# EAGLE design CentralBoard (EAGLE 9.6.2)
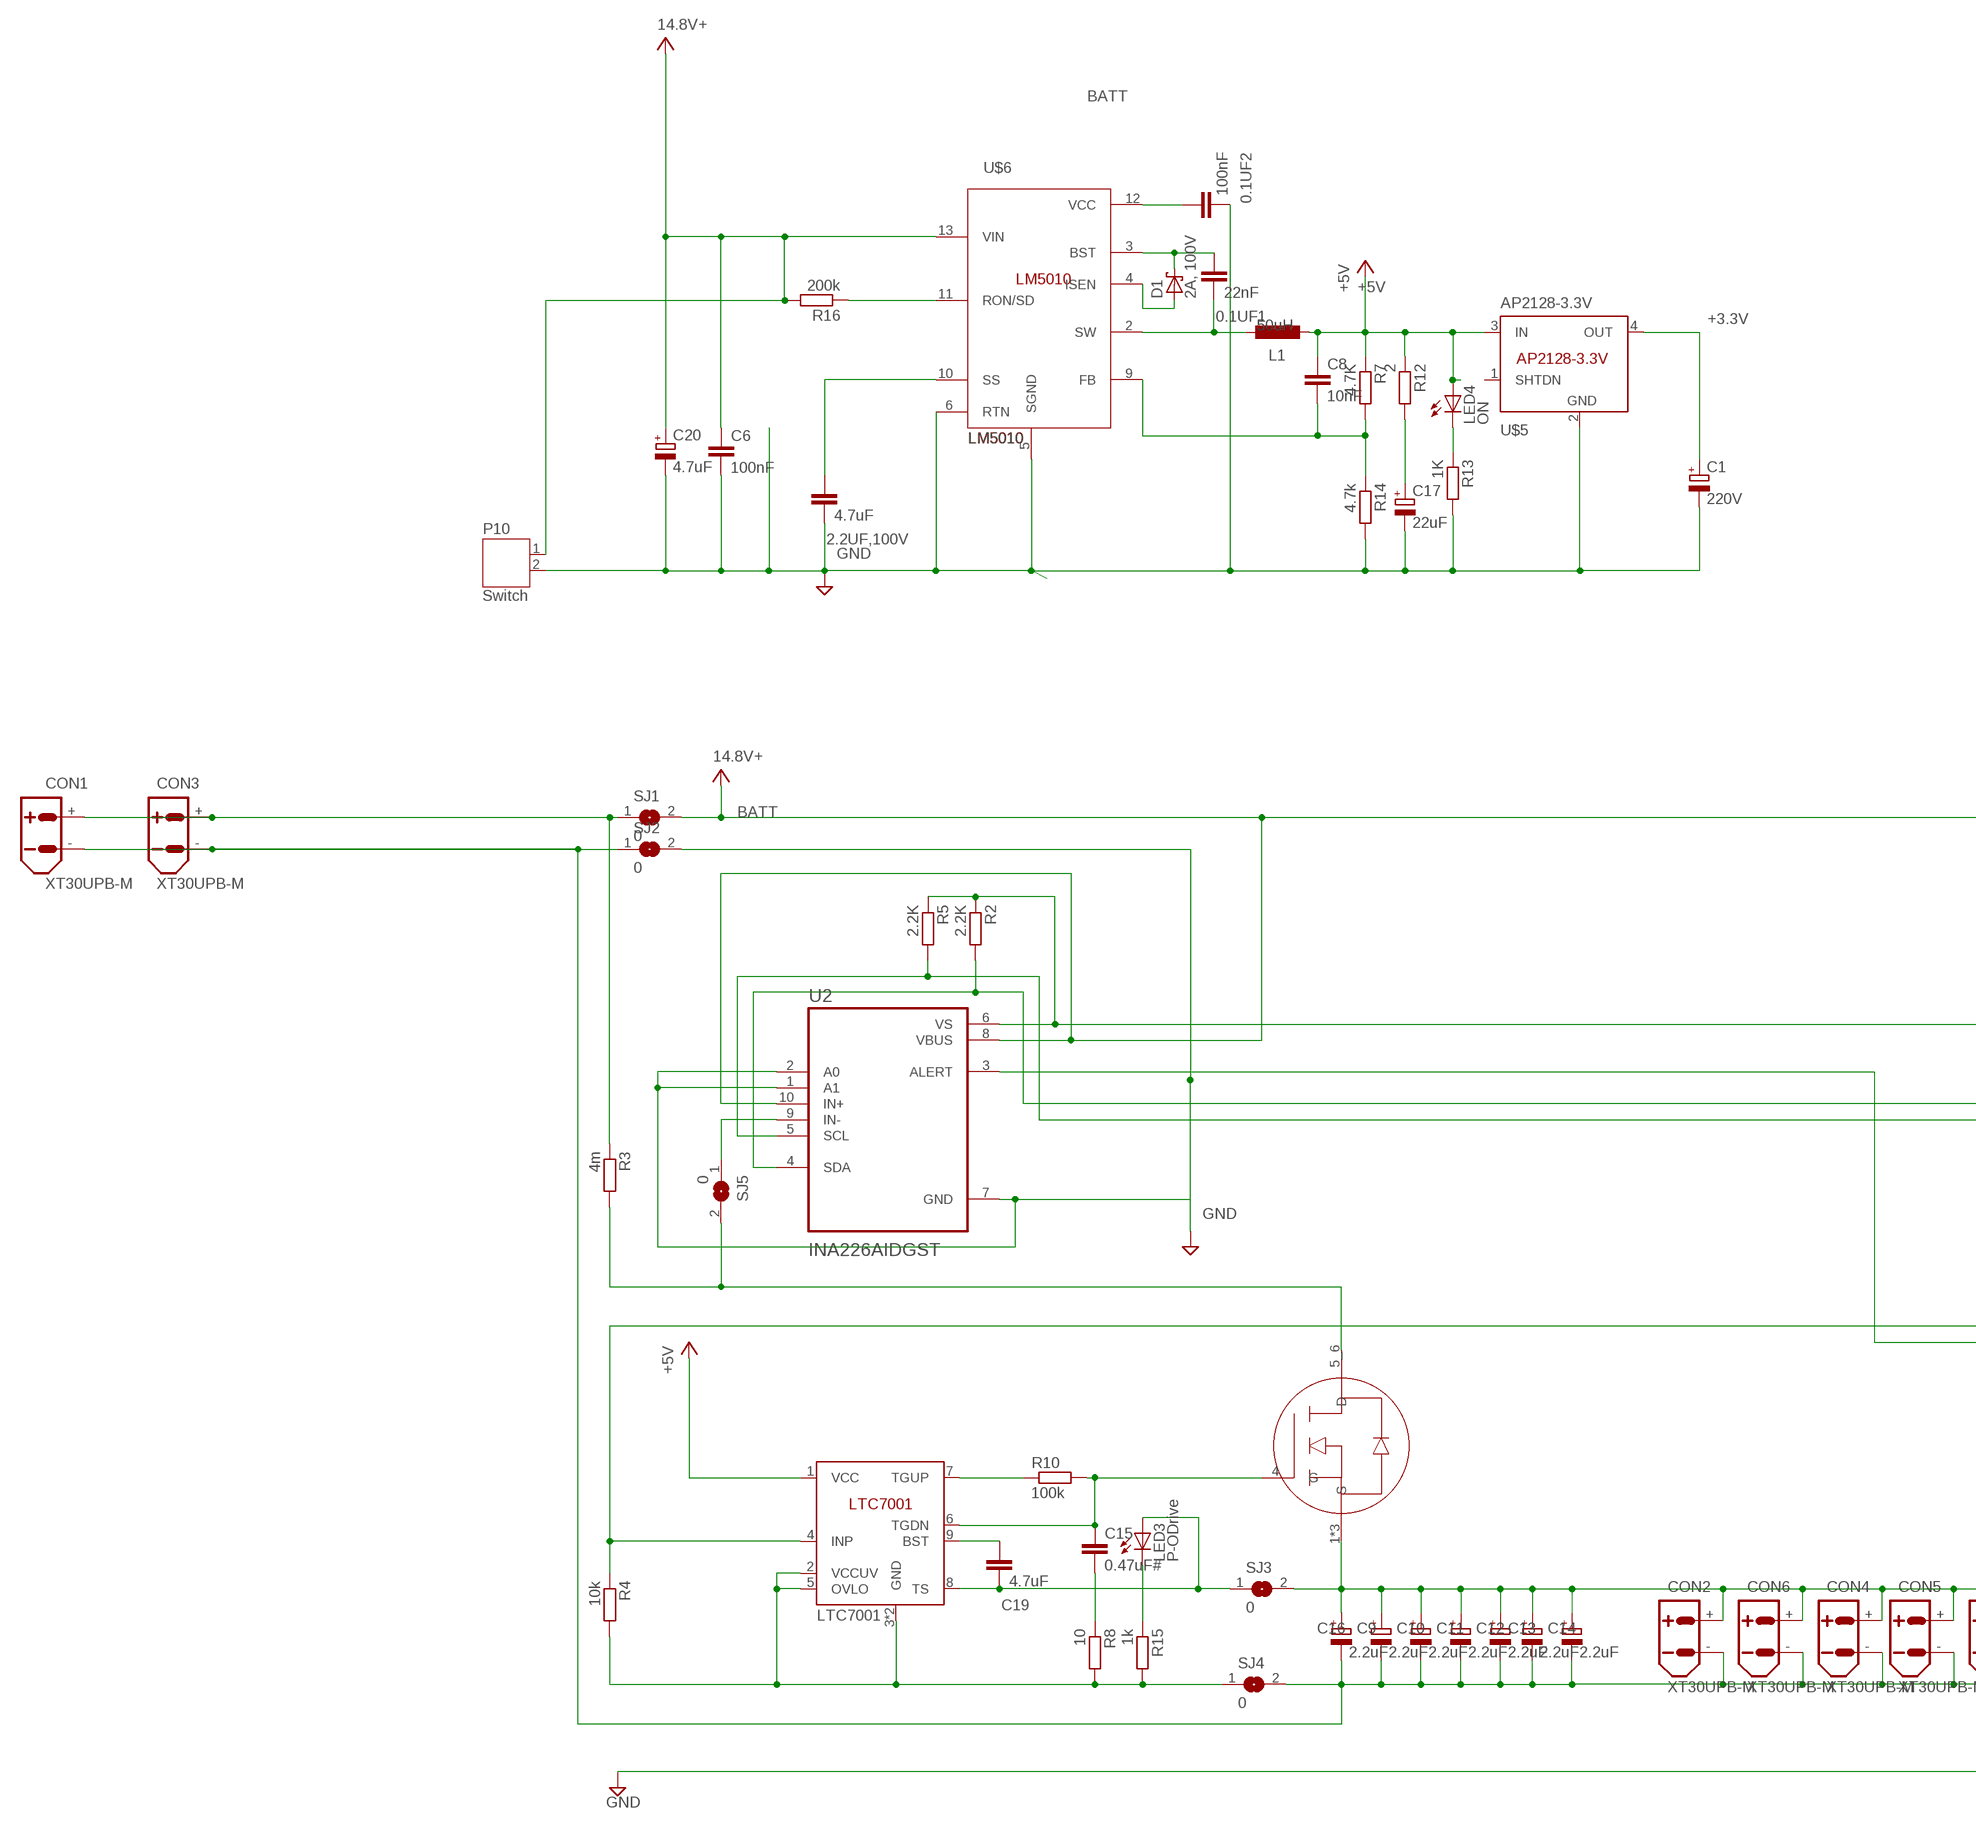
[diagram p0: schematic, sheet 1, part 1 of 2]
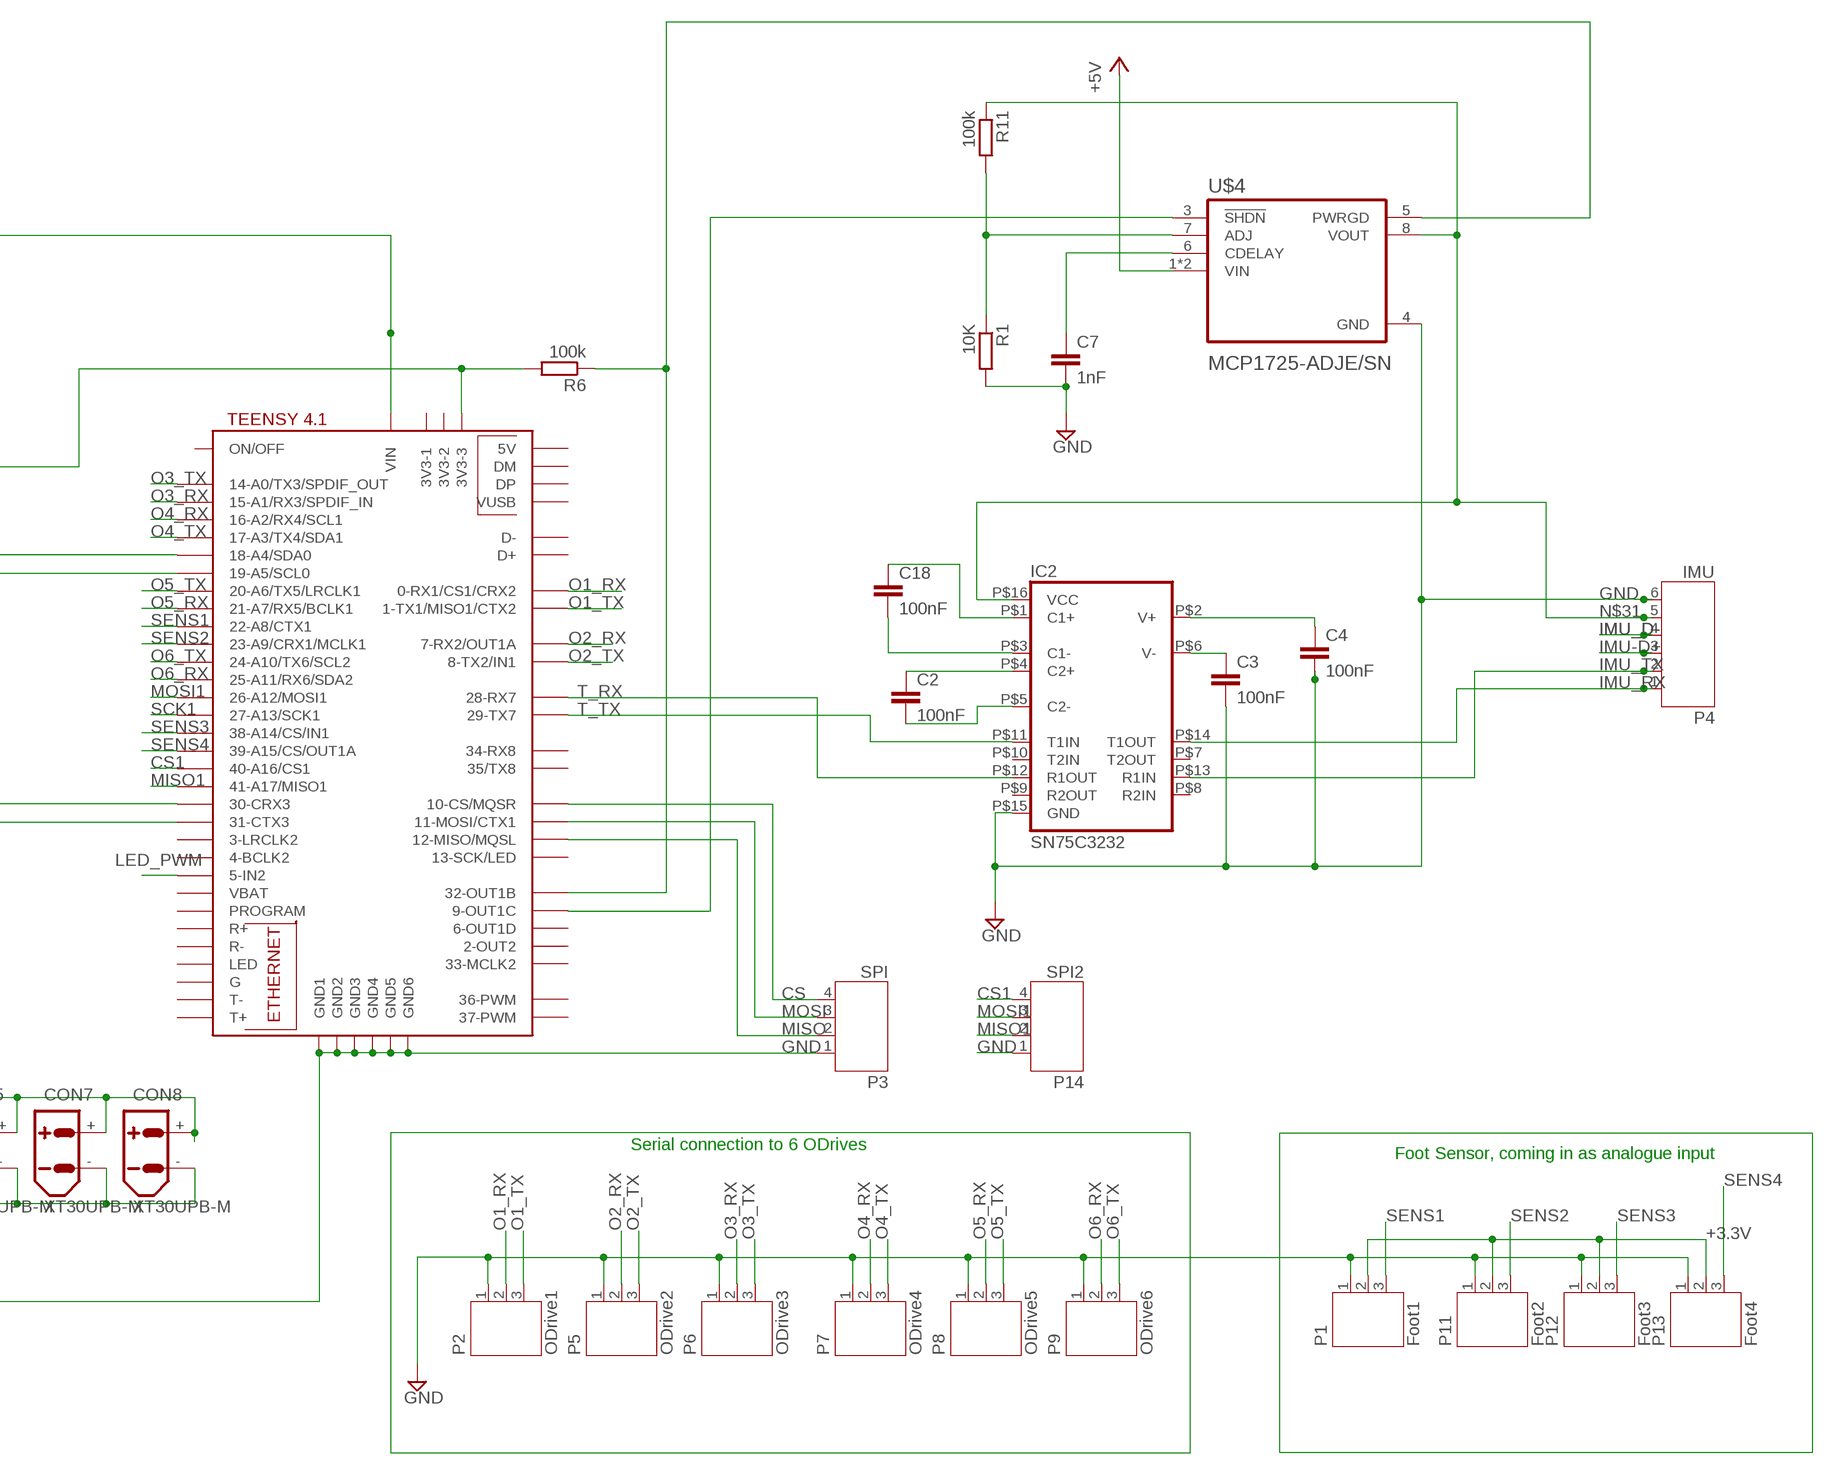
[diagram p1: schematic, sheet 1, part 2 of 2]

## Parts
0.1UF1  22nF  C-EU025-025X050  [C025-025X050]
0.1UF2  100nF  C-EU025-025X050  [C025-025X050]
2.2UF,100V  4.7uF  C-EU025-025X050  [C025-025X050]
C1  220V  CPOL-EUE2.5-7  [E2,5-7]
C2  100nF  C-EU025-025X050  [C025-025X050]
C3  100nF  C-EU025-025X050  [C025-025X050]
C4  100nF  C-EU025-025X050  [C025-025X050]
C6  100nF  C-EU025-025X050  [C025-025X050]
C7  1nF  C-EU025-025X050  [C025-025X050]
C8  10nF  C-EU025-025X050  [C025-025X050]
C9  2.2uF  CPOL-EUE2-5  [E2-5]
C10  2.2uF  CPOL-EUE2-5  [E2-5]
C11  2.2uF  CPOL-EUE2-5  [E2-5]
C12  2.2uF  CPOL-EUE2-5  [E2-5]
C13  2.2uF  CPOL-EUE2-5  [E2-5]
C14  2.2uF  CPOL-EUE2-5  [E2-5]
C15  0.47uF#  C-EU025-025X050  [C025-025X050]
C16  2.2uF  CPOL-EUE2-5  [E2-5]
C17  22uF  CPOL-EUE2-4  [E2-4]
C18  100nF  C-EU025-025X050  [C025-025X050]
C19  4.7uF  C-EU025-025X050  [C025-025X050]
C20  4.7uF  CPOL-EUE2-4  [E2-4]
CON1  XT30UPB-M  [XT30UPB-M]
CON2  XT30UPB-M  [XT30UPB-M]
CON3  XT30UPB-M  [XT30UPB-M]
CON4  XT30UPB-M  [XT30UPB-M]
CON5  XT30UPB-M  [XT30UPB-M]
CON6  XT30UPB-M  [XT30UPB-M]
CON7  XT30UPB-M  [XT30UPB-M]
CON8  XT30UPB-M  [XT30UPB-M]
D1  2A, 100V  SCHOTTKY-DIODEDO41  [DO41-10]
IC2  SN75C3232  MAX3232  [SOIC16]
IC3  LTC7001  [MSOP10]
L1  50uH  L-EU0204/5  [0204/5]
LED3  P-ODrive  LED3MM  [LED3MM]
LED4  ON  LED3MM  [LED3MM]
P1  Foot1  JST-PH3  [JST-PH3]
P2  ODrive1  JST-PH3  [JST-PH3]
P3  SPI  JST-PH4  [JST-PH4]
P4  IMU  JST-PH6  [JST-PH6]
P5  ODrive2  JST-PH3  [JST-PH3]
P6  ODrive3  JST-PH3  [JST-PH3]
P7  ODrive4  JST-PH3  [JST-PH3]
P8  ODrive5  JST-PH3  [JST-PH3]
P9  ODrive6  JST-PH3  [JST-PH3]
P10  Switch  JST-PH2  [JST-PH2]
P11  Foot2  JST-PH3  [JST-PH3]
P12  Foot3  JST-PH3  [JST-PH3]
P13  Foot4  JST-PH3  [JST-PH3]
P14  SPI2  JST-PH4  [JST-PH4]
R1  10K  R-EU_0204/7  [0204/7]
R2  2.2K  R-EU_0204/7  [0204/7]
R3  4m  R-EU_R2512  [R2512]
R4  10k  R-EU_0204/7  [0204/7]
R5  2.2K  R-EU_0204/7  [0204/7]
R6  100k  R-EU_0204/7  [0204/7]
R7  4.7K  R-EU_0204/7  [0204/7]
R8  10  R-EU_0204/7  [0204/7]
R10  100k  R-EU_0204/7  [0204/7]
R11  100k  R-EU_0204/7  [0204/7]
R12  2  R-EU_0204/7  [0204/7]
R13  1K  R-EU_0204/7  [0204/7]
R14  4.7k  R-EU_0204/7  [0204/7]
R15  1k  R-EU_0204/7  [0204/7]
R16  200k  R-EU_0204/7  [0204/7]
SJ1  0  SJ  [SJ]
SJ2  0  SJ  [SJ]
SJ3  0  SJ  [SJ]
SJ4  0  SJ  [SJ]
SJ5  0  SJ  [SJ]
U2  INA226AIDGST  [SOP50P490X110-10N]
U$1  TEENSY41  [TEENSY41]
U$2  DMTH8003SPS  NVMFS6H824NL-D  [DIO_NTS1045EMFST1G]
U$4  MCP1725-ADJE/SN  [SOIC127P599X175-8N]
U$5  AP2128-3.3V  [SOT-23-5]
U$6  LM5010  [TSSOP-14]

## Nets
+3.3V: C1.+ P1.2 P11.2 P12.2 P13.2 U$5.4(OUT)
+5V: C8.1 IC3.1(VCC) L1.2 LED4.A R7.1 R12.1 U$4.1(VIN) U$4.2(VIN) U$5.3(IN)
BATT: C6.1 C20.+ P10.1 R16.2 SJ1.2 U2.8(VBUS) U2.10(IN+) U$6.13(VIN) ; supply symbol labelled 14.8V+
BATT+ [Battery]: CON1.+ CON3.+ R3.1 SJ1.1
BATT- [Battery]: C9.- C10.- C11.- C12.- C13.- C14.- C16.- CON1.- CON2.- CON3.- CON4.- CON5.- CON6.- CON7.- CON8.- SJ2.1 SJ4.2
CS: P3.4 U$1.10-CS\MQSR(10-CS/MQSR)
CS1: P14.4 U$1.40-A16/CS1
GND: 0.1UF2.2 2.2UF,100V.2 C1.- C3.2 C4.2 C6.2 C7.2 C17.- C20.- IC2.P$15(GND) P1.1 P2.1 P3.1 P4.6 P5.1 P6.1 P7.1 P8.1 P9.1 P10.2 P11.1 P12.1 P13.1 P14.1 R1.2 R13.2 R14.2 SJ2.2 U2.1(A1) U2.2(A0) U2.7(GND) U$1.GND1 U$1.GND2 U$1.GND3 U$1.GND4 U$1.GND5 U$1.GND6 U$4.4(GND) U$5.2(GND) U$6.5(SGND) U$6.6(RTN)
IMU-D+: P4.3
IMU_D-: P4.4
IMU_RX: IC2.P$14(T1OUT) P4.1
IMU_TX: IC2.P$13(R1IN) P4.2
IMU_VDD: R6.1 U$1.32-OUT1B U$4.5(PWRGD)
LED_PWM: U$1.5-IN2
MISO: P3.2 U$1.12-MISO/MQSL
MISO1: P14.2 U$1.41-A17/MISO1
MOSI: P3.3 U$1.11-MOSI/CTX1
MOSI1: P14.3 U$1.26-A12/MOSI1
N$1: U$1.VIN
N$2: LED4.K(C) R13.1
N$3: C7.1 U$4.6(CDELAY)
N$4: IC3.7(TGUP) R10.1
N$5: U2.3(ALERT) U$1.31-CTX3
N$6: C18.1 IC2.P$1(C1+)
N$7: U$1.9-OUT1C U$4.3(!SHDN)
N$8: C18.2 IC2.P$3(C1-)
N$9 [Battery]: R3.2 SJ5.2 U$2.5_6(D)
N$10: IC3.4(INP) R4.1 U$1.30-CRX3
N$11: C2.1 IC2.P$4(C2+)
N$12: C2.2 IC2.P$5(C2-)
N$13: C4.1 IC2.P$2(V+)
N$14: C3.1 IC2.P$6(V-)
N$15: IC3.2(VCCUV) IC3.3(GND) IC3.5(OVLO) IC3.11(GND) R4.2 R8.2 R15.2 SJ4.1
N$16: C15.2 R8.1
N$17: R5.2 U2.5(SCL) U$1.19-A5/SCL0
N$18: SJ5.1 U2.9(IN-)
N$19: C15.1 IC3.6(TGDN) R10.2 U$2.4(G)
N$20: C17.+ R12.2
N$21 [Battery]: C9.+ C10.+ C11.+ C12.+ C13.+ C14.+ C16.+ CON2.+ CON4.+ CON5.+ CON6.+ CON7.+ CON8.+ SJ3.2 U$2.1(S) U$2.2(S) U$2.3(S)
N$22: R2.2 U2.4(SDA) U$1.18-A4/SDA0
N$23: R2.1 R5.1 R6.2 U2.6(VS) U$1.3V3-3
N$24: C19.1 IC3.9(BST)
N$25: R1.1 R11.2 U$4.7(ADJ)
N$26: C19.2 IC3.8(TS) LED3.A SJ3.1
N$27: R16.1 U$6.11(RON/SD)
N$29: 0.1UF1.1 D1.C U$6.3(BST)
N$30: LED3.K(C) R15.1
N$31: IC2.P$16(VCC) P4.5 R11.1 U$4.8(VOUT)
N$33: 2.2UF,100V.1 U$6.10(SS)
N$34: 0.1UF2.1 U$6.12(VCC)
N$35: 0.1UF1.2 L1.1 U$6.2(SW)
N$36: C8.2 R7.2 R14.1 U$6.9(FB)
N$37: D1.A U$6.4(ISEN)
O1_RX: P2.2 U$1.0-RX1/CS1/CRX2
O1_TX: P2.3 U$1.1-TX1/MISO1/CTX2
O2_RX: P5.2 U$1.7-RX2/OUT1A
O2_TX: P5.3 U$1.8-TX2/IN1
O3_RX: P6.2 U$1.15-A1/RX3/SPDIF_IN
O3_TX: P6.3 U$1.14-A0/TX3/SPDIF_OUT
O4_RX: P7.2 U$1.16-A2/RX4/SCL1
O4_TX: P7.3 U$1.17-A3/TX4/SDA1
O5_RX: P8.2 U$1.21-A7/RX5/BCLK1
O5_TX: P8.3 U$1.20-A6/TX5/LRCLK1
O6_RX: P9.2 U$1.25-A11/RX6/SDA2
O6_TX: P9.3 U$1.24-A10/TX6/SCL2
SCK1: U$1.27-A13/SCK1
SENS1: P1.3 U$1.22-A8/CTX1
SENS2: P11.3 U$1.23-A9/CRX1/MCLK1
SENS3: P12.3 U$1.38-A14/CS/IN1
SENS4: P13.3 U$1.39-A15/CS/OUT1A
T_RX: IC2.P$12(R1OUT) U$1.28-RX7
T_TX: IC2.P$11(T1IN) U$1.29-TX7
Unconnected: IC2.P$7(T2OUT) IC2.P$8(R2IN) IC2.P$9(R2OUT) IC2.P$10(T2IN) U$1.2-OUT2 U$1.3-LRCLK2 U$1.3V3-1 U$1.3V3-2 U$1.4-BCLK2 U$1.6-OUT1D U$1.13-SCK/LED U$1.33-MCLK2 U$1.34-RX8 U$1.35-TX8(35/TX8) U$1.36-PWM U$1.37-PWM U$1.+5V(5V) U$1.D+ U$1.D- U$1.DM U$1.DP U$1.G U$1.LED U$1.ON/OFF U$1.PROGRAM U$1.R+ U$1.R- U$1.T+ U$1.T- U$1.VBAT U$1.VUSB U$5.1(SHTDN)

## Notes on the sheet
- Serial connection to 6 ODrives
- Foot Sensor, coming in as analogue input

## Library data of the parts
0.1UF1 0.1UF2 2.2UF,100V C2-C4 C6-C8 C15 C18 C19 = rcl:C-EU: CAPACITOR, European symbol; SPICEPREFIX: C
C1 C9-C14 C16 C17 C20 = rcl:CPOL-EU: POLARIZED CAPACITOR, European symbol; SPICEPREFIX: C
CON1-CON8 = amass:XT30: AMASS XT30 connector Store in Japan AMASS XT30 connector <https://szc.jp/ams-xt30>
D1 = adafruit:SCHOTTKY-DIODE: Schottky Diode
IC2 = MAX3232:MAX3232: ±15kV ESD-Protected, Down to 10nA, 3.0V to 5.5V, Up to 1Mbps, True RS-232 Transceivers Check availability <https://pricing.snapeda.com/parts/MAX3232/Maxim%20Integrated/view-part?ref=eda>; AVAILABILITY: In Stock; DESCRIPTION: 2/2 Transceiver Full RS232 16-TQFN (5x5); MF: Maxim Integrated; MP: MAX3232; PACKAGE: SOIC-16 Texas Instruments; PRICE: None; PURCHASE-URL: https://pricing.snapeda.com/search/part/MAX3232/?ref=eda
IC3 = LTC7001:LTC7001: Fast 150V High Side NMOS Static Switch Driver Source: https://www.analog.com/en/products/ltc7001.html; MPN: AD7992BRMZ-0; OC_FARNELL: 1078311; OC_NEWARK: 31M4422
L1 = rcl:L-EU: INDUCTOR, European symbol; SPICEPREFIX: L
LED3 LED4 = adafruit:LED: LED OSRAM: - CHIPLED LG R971, LG N971, LY N971, LG Q971, LY Q971, LO R971, LY R971 LH N974, LH R974 LS Q976, LO Q976, LY Q976 LO Q996 - Hyper CHIPLED LW Q18S LB Q993, LB Q99A, LB R99A - SideLED LS A670, LO A670, LY A670, LG A670, LP A670 LB A673, LV A673, LT A673, LW A673 LH A674 LY A675 LS A676, LA A676, LO A676, LY A676, LW A676 LS A679, LY A679, LG A679 - Hyper Micro SIDELED® LS Y876, LA Y876, LO Y876, LY Y876 LT Y87S - SmartLED LW L88C, LW L88S LB L89C, LB L89S, LG L890 LS L89K, LO L89K, LY L89K LS L896, LA L896, LO L896, LY L896 - TOPLED LS T670, LO T670, LY T670, LG T670, LP T670 LSG T670, LSP T670, LSY T670, LOP T670, LYG T670 LG T671, LOG T671, LSG T671 LB T673, LV T673, LT T673, LW T673 LH T674 LS T676, LA T676, LO T676, LY T676, LB T676, LH T676, LSB T676, LW T676 LB T67C, LV T67C, LT T67C, LS T67K, LO T67K, LY T67K, LW E67C LS E67B, LA E67B, LO E67B, LY E67B, LB E67C, LV E67C, LT E67C LW T67C LS T679, LY T679, LG T679 LS T770, LO T770, LY T770, LG T770, LP T770 LB T773, LV T773, LT T773, LW T773 LH T774 LS E675, LA E675, LY E675, LS T675 LS T776, LA T776, LO T776, LY T776, LB T776 LHGB T686 LT T68C, LB T68C - Hyper Mini TOPLED® LB M676 - Mini TOPLED Santana® LG M470 LS M47K, LO M47K, LY M47K Source: http://www.osram.convergy.de/
P1 P2 P5-P9 P11-P13 = jst-ph:JST-PH3
P3 P14 = jst-ph:JST-PH4
P4 = jst-ph:JST-PH6
P10 = jst-ph:JST-PH2
R1 R2 R4-R8 R10-R16 = rcl:R-EU_: RESISTOR, European symbol; SPICEPREFIX: R
R3 = rcl:R-EU_: RESISTOR, European symbol; DIGIKEY: 541-WSK25124L000FEACT-ND; LINK: https://octopart.com/wsk25124l000fea-vishay-41934978?r=sp; MOUSER: 71-WSK25124L000FEA; SPICEPREFIX: R
SJ1-SJ5 = jumper:SJ: SMD solder JUMPER
U2 = INA226AIDGST:INA226AIDGST: Check availability <https://pricing.snapeda.com/parts/INA226AIDGST/Texas%20Instruments/view-part?ref=eda>; AVAILABILITY: In Stock; DESCRIPTION: 36V, 16-bit, ultra-precise i2c output current/voltage/power monitor w/alert; MF: Texas Instruments; MP: INA226AIDGST; PACKAGE: VSSOP-10 Texas Instruments; PRICE: None; PURCHASE-URL: https://pricing.snapeda.com/search/part/INA226AIDGST/?ref=eda
U$1 = teensy:TEENSY41
U$2 = DIO_NTS1045EMFST1G:NVMFS6H824NL-D
U$4 = MCP1725-ADJE_SN:MCP1725-ADJE/SN: Check availability <https://pricing.snapeda.com/parts/MCP1725-ADJE/SN/Microchip/view-part?ref=eda>; AVAILABILITY: In Stock; DESCRIPTION: Linear Voltage Regulator IC Positive Adjustable 1 Output 500mA 8-SOIC; MF: Microchip; MP: MCP1725-ADJE/SN; PACKAGE: SOIC-8 Microchip; PRICE: None; PURCHASE-URL: https://pricing.snapeda.com/search/part/MCP1725-ADJE/SN/?ref=eda
U$5 = AP2128:AP2128-3.3V: AP2128-3.3V 300mA HIGH SPEED, EXTREMELY LOW NOISE CMOS LDO REGULATOR https://www.diodes.com/assets/Datasheets/AP2128.pdf
U$6 = LM5010:LM5010: LM5010 High-Voltage 1-A Step-Down Switching Regulator https://www.ti.com/lit/ds/symlink/lm5010.pdf?ts=1653069920582

## Net classes
0 default: width 0.254 mm
1 Battery: width 1.397 mm

## Board
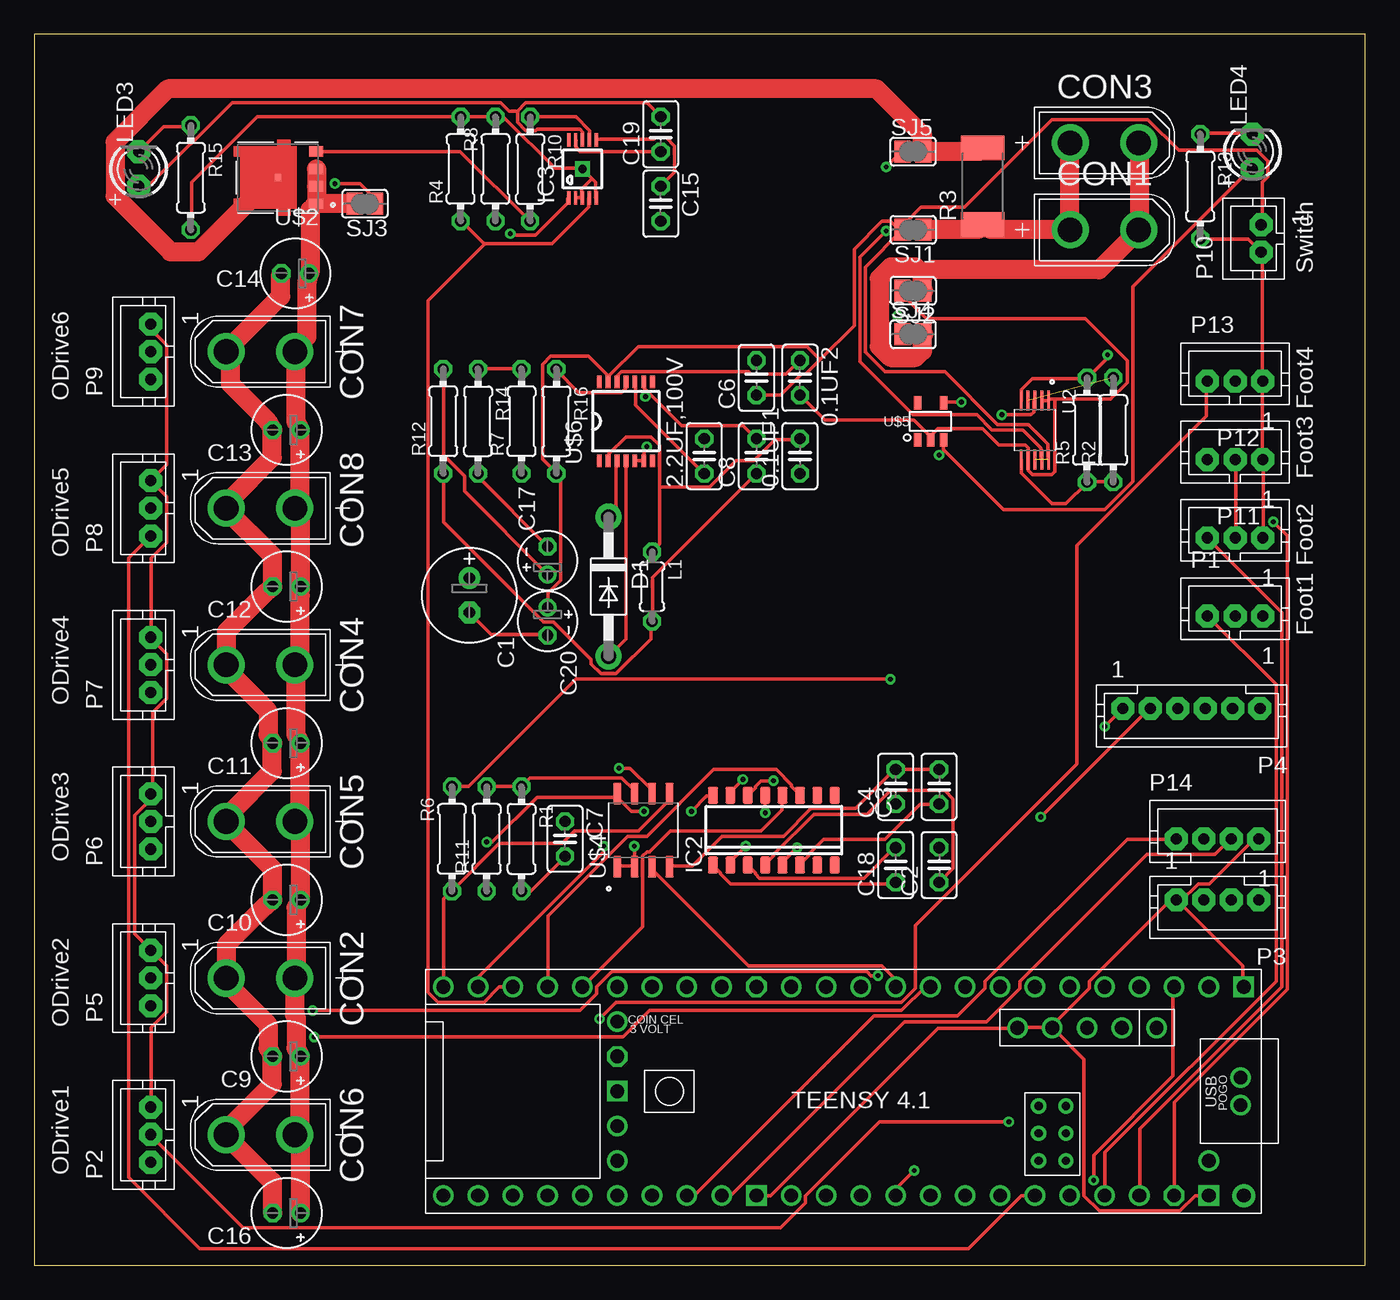
[diagram p2: board, top side]
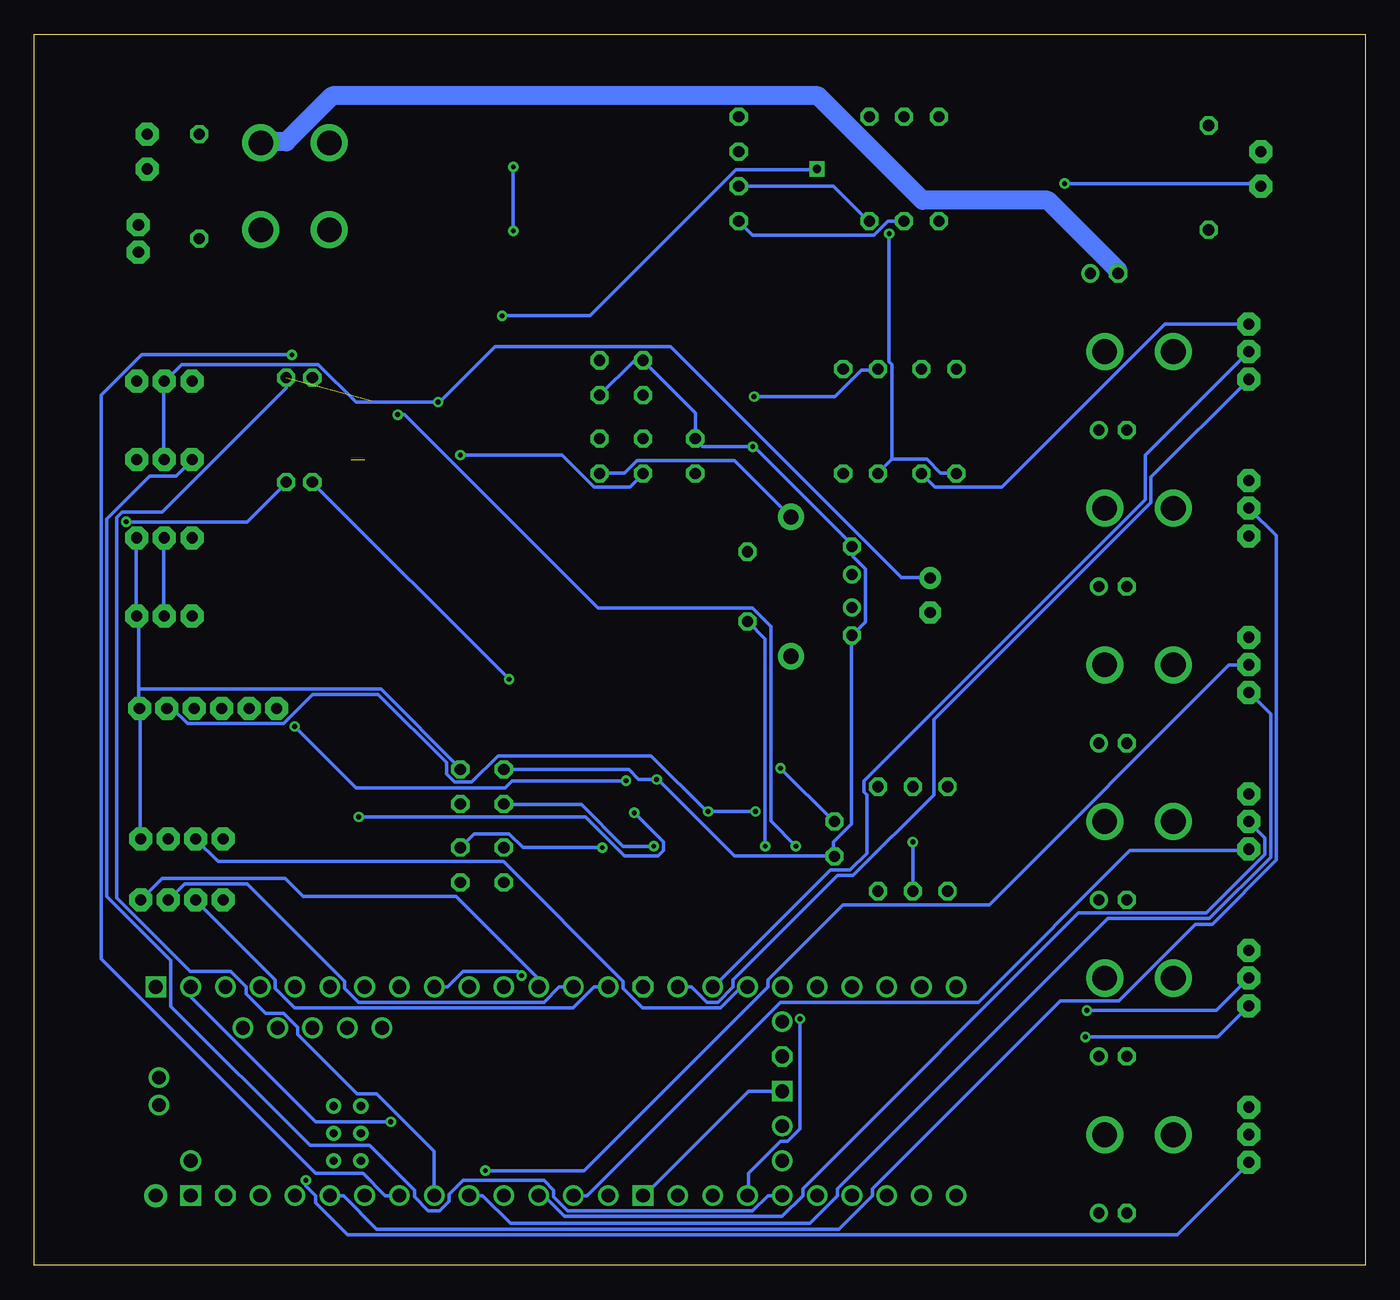
[diagram p3: board, bottom side, seen from below]

Size 97.14 x 89.84 mm. Coordinates in mm from the lower left corner, seen from the top.
Outline: 0,0 97.14,0 97.14,89.84 0,89.84 0,0
Copper layers (1*16): Top 0.035mm / dielectric 1.5mm / Bottom 0.035mm
Design rules "default": minimum track width 6mil, minimum drill 0.35mm, track to track 6mil, track to pad 6mil, pad to pad 6mil, via to via 6mil, smd to smd 6mil, copper to edge 40mil, drill to drill 6mil, minimum pad ring 10mil, minimum via ring 8mil, stop-mask expansion 4mil, vias tented up to drill 0mil, thermal gap 10mil

### Footprints (pad centres in the part's own frame; a part is rotated, then mirrored left to right if it is on the bottom)
C025-025X050 = drill 0.813 octagon: 1 -1.27,0; 2 1.27,0
E2,5-7 = drill 0.813 pad 1.6: + -1.27,0 | drill 0.813 pad 1.6 octagon: - 1.27,0
E2-5 = drill 0.813 pad 1.27: + -1.016,0 | drill 0.813 pad 1.27 octagon: - 1.016,0
E2-4 = drill 0.813 pad 1.27: + -1.016,0 | drill 0.813 pad 1.27 octagon: - 1.016,0
XT30UPB-M = drill 1.8: + 2.5,0; - -2.5,0
DO41-10 = drill 1.118 pad 1.93: A 5.08,0; C -5.08,0
SOIC16 = smd 0.75 x 1.25: P$1 -4.445,-2.54; P$2 -3.175,-2.54; P$3 -1.905,-2.54; P$4 -0.635,-2.54; P$5 0.635,-2.54; P$6 1.905,-2.54; P$7 3.175,-2.54; P$8 4.445,-2.54; P$9 4.445,2.54; P$10 3.175,2.54; P$11 1.905,2.54; P$12 0.635,2.54; P$13 -0.635,2.54; P$14 -1.905,2.54; P$15 -3.175,2.54; P$16 -4.445,2.54
MSOP10 = smd 0.25 x 1: 1 -1,-2.113; 2 -0.5,-2.113; 3 0,-2.113; 4 0.5,-2.113; 5 1,-2.113; 6 1,2.113; 7 0.5,2.113; 8 0,2.113; 9 -0.5,2.113; 10 -1,2.113 | drill 0.6 square: 11 0,0
0204/5 = drill 0.813 octagon: 1 -2.54,0; 2 2.54,0
LED3MM = drill 0.813 pad 1.676 octagon: A -1.27,0; K 1.27,0
JST-PH3 = drill 0.813 pad 1.676 octagon: 1 2.016,-1.524; 2 0.016,-1.524; 3 -2.016,-1.524
JST-PH4 = drill 0.813 pad 1.676 octagon: 1 3,0; 2 1,0; 3 -1,0; 4 -3,0
JST-PH6 = drill 0.813 pad 1.676 octagon: 1 5,0; 2 3,0; 3 1,0; 4 -1,0; 5 -3,0; 6 -5,0
JST-PH2 = drill 0.813 pad 1.676 octagon: 1 1,0; 2 -1,0
0204/7 = drill 0.813 octagon: 1 -3.81,0; 2 3.81,0
R2512 = smd 1.8 x 3.2: 1 -2.8,0; 2 2.8,0
SJ = smd 1.168 x 1.6: 1 -0.762,0; 2 0.762,0
SOP50P490X110-10N = smd 1.47 x 0.28: 1 -2.15,1; 2 -2.15,0.5; 3 -2.15,0; 4 -2.15,-0.5; 5 -2.15,-1; 6 2.15,-1; 7 2.15,-0.5; 8 2.15,0; 9 2.15,0.5; 10 2.15,1
TEENSY41 = drill 1: 0-RX1/CS1/CRX2 -27.94,-7.62; 1-TX1/MISO1/CTX2 -25.4,-7.62; 2-OUT2 -22.86,-7.62; 3-LRCLK2 -20.32,-7.62; 4-BCLK2 -17.78,-7.62; 5-IN2 -15.24,-7.62; 6-OUT1D -12.7,-7.62; 7-RX2/OUT1A -10.16,-7.62; 8-TX2/IN1 -7.62,-7.62; 9-OUT1C -5.08,-7.62; 10-CS\MQSR -2.54,-7.62; 11-MOSI/CTX1 0,-7.62; 12-MISO/MQSL 2.54,-7.62; 13-SCK/LED 2.54,7.62; 14-A0/TX3/SPDIF_OUT 0,7.62; 15-A1/RX3/SPDIF_IN -2.54,7.62; 16-A2/RX4/SCL1 -5.08,7.62; 17-A3/TX4/SDA1 -7.62,7.62; 18-A4/SDA0 -10.16,7.62; 19-A5/SCL0 -12.7,7.62; 20-A6/TX5/LRCLK1 -15.24,7.62; 21-A7/RX5/BCLK1 -17.78,7.62; 22-A8/CTX1 -20.32,7.62; 23-A9/CRX1/MCLK1 -22.86,7.62; 24-A10/TX6/SCL2 7.62,-7.62; 25-A11/RX6/SDA2 10.16,-7.62; 26-A12/MOSI1 12.7,-7.62; 27-A13/SCK1 15.24,-7.62; 28-RX7 17.78,-7.62; 29-TX7 20.32,-7.62; 30-CRX3 22.86,-7.62; 31-CTX3 25.4,-7.62; 32-OUT1B 27.94,-7.62; 33-MCLK2 27.94,7.62; 34-RX8 25.4,7.62; 35-TX8 22.86,7.62; 36-PWM 20.32,7.62; 37-PWM 17.78,7.62; 38-A14/CS/IN1 15.24,7.62; 39-A15/CS/OUT1A 12.7,7.62; 40-A16/CS1 10.16,7.62; 41-A17/MISO1 7.62,7.62; +5V -24.13,-4.62; D+ -30.25,-1; D- -30.25,1; DM -21.59,-4.62; DP -19.05,-4.62; GND4 -16.51,-4.62; GND5 -13.97,-4.62; ON/OFF 15.24,5.08; PROGRAM 15.24,2.54; VBAT 15.24,-5.08; VUSB -27.94,5.08 | drill 1 octagon: 3V3-1 5.08,-7.62; 3V3-2 15.24,-2.54; 3V3-3 -25.4,7.62 | drill 0.6: G -15.51,3.08; LED -17.51,3.08; R+ -17.51,5.08; R- -15.51,5.08; T+ -15.51,1.08; T- -17.51,1.08 | drill 1 square: GND1 -30.48,-7.62; GND2 15.24,0; GND3 5.08,7.62; GND6 -27.94,7.62 | drill 1 pad 1.676: VIN -30.48,7.62
DIO_NTS1045EMFST1G = smd 1 x 0.75: 1 -2.795,1.905; 2 -2.795,0.635; 3 -2.795,-0.635; 4 -2.795,-1.905 | smd 0.5 x 0.5: 5_6 0,0
SOIC127P599X175-8N = smd 1.58 x 0.6: 1 -2.67,1.905; 2 -2.67,0.635; 3 -2.67,-0.635; 4 -2.67,-1.905; 5 2.67,-1.905; 6 2.67,-0.635; 7 2.67,0.635; 8 2.67,1.905
SOT-23-5 = smd 1 x 0.55: 1 -1.35,0.95; 2 -1.35,0; 3 -1.35,-0.95; 4 1.35,-0.95; 5 1.35,0.95
TSSOP-14 = smd 0.9 x 0.35: 1 -2.875,1.95; 2 -2.875,1.3; 3 -2.875,0.65; 4 -2.875,0; 5 -2.875,-0.65; 6 -2.875,-1.3; 7 -2.875,-1.95; 8 2.875,-1.95; 9 2.875,-1.3; 10 2.875,-0.65; 11 2.875,0; 12 2.875,0.65; 13 2.875,1.3; 14 2.875,1.95

### Placement (x,y rotation side)
0.1UF1  55.88,59.05 90 top
0.1UF2  55.88,64.77 270 top
2.2UF,100V  48.9,59.05 90 top
C1  31.75,48.9 270 top
C2  66.04,29.21 90 top
C3  66.04,34.92 90 top
C4  62.87,34.92 90 top
C6  52.7,64.77 90 top
C7  38.73,31.11 270 top
C8  52.7,59.05 90 top
C9  18.41,15.24 180 top
C10  18.41,26.67 180 top
C11  18.41,38.1 180 top
C12  18.41,49.53 180 top
C13  18.41,60.96 180 top
C14  19.05,72.39 180 top
C15  45.72,77.47 270 top
C16  18.41,3.81 180 top
C17  37.47,51.44 90 top
C18  62.87,29.21 90 top
C19  45.72,82.55 90 top
C20  37.47,46.99 270 top
CON1  78.11,75.56 180 top
CON2  16.51,20.95 0 top
CON3  78.11,81.92 180 top
CON4  16.51,43.81 0 top
CON5  16.51,32.38 0 top
CON6  16.51,9.53 0 top
CON7  16.51,66.67 0 top
CON8  16.51,55.24 0 top
D1  41.91,49.53 270 top
IC2  53.98,31.75 0 top
IC3  40.01,80.01 0 top
L1  45.09,49.53 270 top
LED3  7.62,80.01 90 top
LED4  88.9,81.28 90 top
P1  87.63,48.9 0 top
P2  6.99,9.53 90 top
P3  86.36,26.67 180 top
P4  84.45,40.64 180 top
P5  6.99,20.95 90 top
P6  6.99,32.38 90 top
P7  6.99,43.81 90 top
P8  6.99,55.24 90 top
P9  6.99,66.67 90 top
P10  89.53,74.93 90 top
P11  87.63,54.61 0 top
P12  87.63,60.33 0 top
P13  87.63,66.04 0 top
P14  86.36,31.11 0 top
R1  35.56,31.11 270 top
R2  78.74,60.96 90 top
R3  69.22,78.74 90 top
R4  31.11,80.01 90 top
R5  76.83,60.96 90 top
R6  30.48,31.11 90 top
R7  35.56,61.59 90 top
R8  33.66,80.01 90 top
R10  36.2,80.01 270 top
R11  33.02,31.11 90 top
R12  29.84,61.59 90 top
R13  85.09,78.74 270 top
R14  32.38,61.59 270 top
R15  11.43,79.38 270 top
R16  38.1,61.59 270 top
SJ1  64.14,75.56 180 top
SJ2  64.14,71.12 180 top
SJ3  24.13,77.47 180 top
SJ4  64.14,67.94 0 top
SJ5  64.14,81.28 0 top
U2  73.03,60.96 270 top
U$1  57.78,12.7 180 top
U$2  17.78,79.38 180 top
U$4  44.45,31.75 90 top
U$5  65.41,61.59 90 top
U$6  43.18,61.59 90 top

### Tracks (layer width: path | path; a pad name or v marks a point on that pad's centre or on a via)
+3.3V  (via drill 0.35)
  Top 0.254: v67.67,62.99 66.45,62.99 U$5.4 | P11.2 87.68,53.14 87.68,58.73 P12.2
  Bottom 0.254: P1.2 87.68,47.45 87.68,53.03 P11.2 | C1.+ 31.8,50.19 33.83,50.19 50.7,67.06 63.5,67.06 67.56,62.99 v67.67,62.99 73.66,62.99 76.4,65.73 86.36,65.73 87.58,64.52 P13.2 87.68,64.41 87.68,58.83 P12.2
+5V  (via drill 0.35)
  Top 0.254: v34.75,75.29 34.85,75.18 36.58,75.18 38.91,77.52 38.91,77.83 IC3.1 | U$4.1 42.57,29.16 43.79,29.16 U$4.2 43.79,29.26 v43.79,30.58 | 66.34,59.44 66.34,60.15 U$5.3 | v66.04,59.13 66.34,59.44 | LED4.A 88.9,79.96 88.7,79.96 80.16,71.42 80.16,57.2 78.13,55.17 70.71,55.17 66.45,59.44 66.34,59.44 | C8.1 45.11,50.19 45.11,47.04 L1.2 45.01,46.94 45.01,45.72 42.47,43.18 41.35,43.18 40.64,43.89 40.64,44.2 37.9,46.94 37.19,46.94 29.87,54.25 29.87,57.71 R12.1
  Bottom 0.254: v34.75,75.29 34.75,65.94 34.54,65.73 34.54,58.83 | 34.54,58.83 35.56,57.81 R7.1 | 34.54,58.83 32,58.83 30.99,57.81 29.87,57.81 R12.1 | v43.79,30.58 43.79,45.72 45.01,46.94 L1.2 | v66.04,59.13 58.62,59.13 56.29,56.79 53.65,56.79 52.73,57.71 C8.1
BATT  (1 unrouted)
  Top 0.254: 41.86,64.92 41.86,64.52 U$6.13 | 41.86,64.92 40.44,66.34 37.69,66.34 37.08,65.73 37.08,58.83 38.1,57.81 R16.2 38.2,57.71 38.41,57.51 38.41,49.99 37.49,49.07 37.49,48.06 C20.+ | SJ1.2 60.66,72.85 60.66,66.65 62.08,65.23 66.45,65.23 70.31,61.37 72.54,61.37 73.97,59.94 73.97,58.83 U2.10 | C6.1 54.46,63.5 55.98,65.02 56.29,65.02 57.35,66.09 | 57.35,66.09 59.84,68.58 59.84,74.17 61.87,76.2 62.48,76.2 63.2,75.49 SJ1.2 | P10.1 89.61,76 89.61,79.05 90.02,79.45 90.02,80.57 89.2,81.38 83.52,81.38 81.28,83.62 74.27,83.62 67.87,77.22 64.72,77.22 63.5,76 63.5,75.59 SJ1.2 | 57.35,66.09 56.39,67.06 44.09,67.06 41.96,64.92 41.86,64.92
BATT+
  Top 1.397: SJ1.1 64.92,75.59 68.89,75.59 69.19,75.89 R3.1 69.8,75.59 75.59,75.59 CON1.+ 75.59,76.2 75.59,81.89 CON3.+
BATT-
  Top 1.397: C16.- 17.37,3.86 17.37,6.1 14.02,9.45 CON6.- 14.33,10.16 17.37,13.21 17.37,15.24 | 17.37,15.24 C9.- | 17.37,38.1 17.37,36.07 14.33,33.02 CON5.- 14.02,32.31 17.37,28.96 17.37,26.72 C10.- 16.87,26.21 14.02,23.37 14.02,21.03 CON2.- 14.33,20.32 17.07,17.58 17.07,15.85 17.37,15.24 | 17.37,38.1 C11.- | 64.82,72.34 64.31,72.85 62.48,72.85 61.67,72.03 61.67,67.06 62.48,66.24 64.31,66.24 64.82,66.75 64.82,67.87 SJ4.2 | 64.82,72.34 64.82,71.12 SJ2.1 | 64.82,72.34 65.43,72.64 77.72,72.64 80.57,75.49 CON1.- 80.67,76.2 80.67,81.89 CON3.- | C14.- 17.98,72.34 17.98,70.71 14.02,66.75 CON7.- 14.33,66.04 14.33,64.31 17.07,61.57 17.37,60.96 | 17.37,60.96 17.37,58.93 14.33,55.88 CON8.- 14.02,55.17 17.37,51.82 17.37,49.58 C12.- 16.87,49.07 14.02,46.23 14.02,43.89 CON4.- 14.33,43.18 17.07,40.44 17.07,38.71 17.37,38.1 | 17.37,60.96 C13.-
  Bottom 1.397: CON3.- 80.57,81.99 78.74,81.99 75.39,85.34 39.93,85.34 32.31,77.72 23.16,77.72 18.09,72.64 18.09,72.44 C14.-
CS
  Bottom 0.254: U$1.10-CS\MQSR 60.35,20.32 60.35,20.93 66.34,26.92 77.52,26.92 78.84,28.25 87.78,28.25 89.31,26.72 P3.4
CS1
  Top 0.254: U$1.40-A16/CS1 48.16,5.08 61.27,18.19 67.36,18.19 69.39,20.22 69.39,20.73 79.76,31.09 83.31,31.09 P14.4
GND  (via drill 0.35)
  Top 0.254: U$1.GND4 74.27,17.37 71.83,17.37 U$1.GND5 71.73,17.27 65.94,17.27 53.75,5.08 U$1.GND3 | U$1.GND6 84.73,5.08 83.62,3.96 77.72,3.96 76.61,5.08 76.61,15.04 74.37,17.27 U$1.GND4 | U$1.GND1 88.19,20.32 88.19,21.84 83.41,26.62 P3.1 | P14.1 89.31,31.09 89,31.09 85.75,27.84 84.94,27.84 83.62,26.52 P3.1 | R13.2 85.14,74.88 88.59,74.88 89.51,73.97 P10.2 89.61,73.86 89.61,64.62 P13.1 89.61,64.52 89.61,58.93 P12.1 89.71,58.73 89.71,53.14 P11.1 | U$1.GND4 74.27,17.48 77.01,20.22 77.01,20.73 82.91,26.62 83.31,26.62 P3.1 | P2.1 8.53,11.58 8.53,17.37 9.65,18.49 9.65,21.84 8.53,22.96 P5.1 8.43,23.06 7.32,24.18 7.32,32.82 8.43,33.93 8.43,34.34 P6.1 8.64,34.44 8.64,40.34 9.65,41.35 9.65,44.6 8.53,45.72 P7.1 8.53,45.92 8.53,51.61 9.65,52.73 9.65,56.08 8.53,57.2 P8.1 8.53,57.3 9.65,58.42 9.65,67.16 8.53,68.28 8.53,68.68 P9.1 | R1.2 35.56,27.33 36.27,27.33 38.71,29.77 C7.2 | IC2.P$15 50.8,34.54 v51.71,35.46 | U$4.4 46.43,29.16 48.06,29.16 50.19,31.29 54.66,31.29 56.69,33.33 59.94,33.33 62.79,36.17 C4.2 62.99,36.17 66.04,36.17 C3.2 | U2.2 73.56,63.09 73.97,63.09 U2.1 74.07,63.2 74.47,63.2 | 74.47,63.2 78.54,63.2 79.76,64.41 79.76,66.04 76.71,69.09 65.13,69.09 63.4,70.81 63.4,71.12 SJ2.2 | 74.47,63.2 74.47,57.91 74.27,57.71 72.85,57.71 72.54,58.01 72.54,58.73 U2.7 72.54,58.83 72.54,59.64 72.34,59.84 70.41,59.84 69.19,61.06 65.94,61.06 65.43,60.55 65.43,60.25 U$5.2 65.33,60.55 64.21,61.67 57.71,61.67 0.1UF2.2 | U$6.5 43.89,58.73 44.4,58.73 U$6.6 44.5,58.83 44.5,59.54 v44.7,59.74 | C20.- 37.39,46.02 33.33,46.02 31.8,47.55 C1.- | C17.- 32.41,57.51 32.41,57.71 R14.2
  Bottom 0.254: U$1.GND2 45.01,12.7 52.63,5.08 U$1.GND3 | 89.51,42.06 89.51,47.24 89.61,47.35 P1.1 89.71,47.45 89.71,53.03 P11.1 | 89.51,42.06 89.51,40.64 P4.6 89.41,40.54 89.41,31.19 P14.1 | C4.2 62.79,36.17 53.75,36.17 53.03,35.46 v51.71,35.46 51.61,35.46 46.02,29.87 38.81,29.87 C7.2 38.81,29.97 38.81,30.89 37.49,32.21 37.49,45.92 C20.- 37.39,46.02 36.47,46.94 36.47,50.8 37.39,51.71 37.39,52.43 C17.- 37.39,52.53 44.6,59.74 v44.7,59.74 48.36,59.74 48.87,60.25 2.2UF,100V.2 48.87,60.45 48.87,62.18 52.63,65.94 C6.2 53.34,66.04 0.1UF2.2 | R14.2 31.39,56.79 26.52,56.79 14.63,68.68 8.53,68.68 P9.1 | 89.51,42.06 71.83,42.06 66.04,36.27 C3.2
IMU_RX  (via drill 0.35)
  Top 0.254: IC2.P$14 52.63,34.85 52.63,34.95 53.03,35.36 v53.95,35.36 | v78.13,39.32 P4.1
  Bottom 0.254: v53.95,35.36 62.28,35.36 62.79,34.85 73.66,34.85 v78.13,39.32
IMU_TX  (via drill 0.35)
  Top 0.254: v53.34,33.02 IC2.P$13 | v73.46,32.72 81.38,40.64 P4.2
  Bottom 0.254: v53.34,33.02 51.21,30.89 51.21,30.28 51.61,29.87 54.05,29.87 56.9,32.72 v73.46,32.72
IMU_VDD
  Top 0.254: U$4.5 46.33,34.34 46.33,33.93 44.09,31.7 39.42,31.7 38.51,30.79 33.93,30.79 30.48,27.33 R6.1 30.38,27.23 29.87,26.72 29.87,20.32 U$1.32-OUT1B
MISO
  Bottom 0.254: U$1.12-MISO/MQSL 56.29,20.32 57.81,18.8 78.13,18.8 79.55,20.22 79.55,20.83 85.34,26.62 P3.2
MISO1
  Top 0.254: U$1.41-A17/MISO1 50.8,5.08 63.5,17.78 69.49,17.78 71.93,20.22 71.93,20.73 81.18,29.97 86.16,29.97 87.27,31.09 P14.2
MOSI
  Bottom 0.254: U$1.11-MOSI/CTX1 58.83,20.32 59.94,19.2 73.46,19.2 74.47,20.22 74.47,20.73 81.58,27.84 86.16,27.84 87.27,26.72 P3.3
MOSI1
  Bottom 0.254: U$1.26-A12/MOSI1 45.52,20.32 47.04,18.8 52.73,18.8 54.15,20.22 54.15,20.73 62.89,29.46 83.72,29.46 85.34,31.09 P14.3
N$2
  Top 0.254: R13.1 85.14,82.6 88.9,82.6 LED4.K
N$3  (via drill 0.35)
  Top 0.254: v42.67,36.27 43.48,36.27 45.01,34.75 45.01,34.44 U$4.6
  Bottom 0.254: v42.67,36.27 38.81,32.41 C7.1
N$4
  Top 0.254: R10.1 39.52,83.82 40.54,82.8 40.54,82.19 IC3.7
N$5  (via drill 0.35)
  Top 0.254: v70.61,62.08 72.75,62.08 72.95,62.28 72.95,63.09 U2.3 | v41.55,30.58 41.55,30.18 32.41,21.03 32.41,20.32 U$1.31-CTX3
  Bottom 0.254: v70.61,62.08 70.1,62.08 55.98,47.95 44.7,47.95 43.38,46.63 43.38,32.41 v41.55,30.58
N$6
  Top 0.254: IC2.P$1 50.09,28.65 50.09,28.55 50.8,27.84 62.69,27.84 62.79,27.94 C18.1
N$7
  Top 0.254: U$4.3 45.11,29.06 45.11,28.85 52.12,21.84 61.87,21.84 62.79,20.93 62.79,20.32 U$1.9-OUT1C
N$8
  Top 0.254: IC2.P$3 52.63,28.65 52.63,28.55 52.93,28.25 60.55,28.25 62.79,30.48 C18.2
N$9
  Top 1.397: R3.2 69.19,81.48 68.99,81.28 SJ5.2 64.82,81.89 64.82,82.5 61.47,85.85 9.75,85.85 5.89,81.99 5.89,78.03 9.96,73.97 11.99,73.97 17.37,79.35 17.78,79.35 U$2.5_6
N$10
  Top 0.254: 32.82,74.57 37.8,74.57 40.44,77.22 40.44,77.83 IC3.4 | 32.82,74.57 31.19,76.2 R4.1 | U$1.30-CRX3 33.93,20.32 32.82,19.2 29.46,19.2 28.75,19.91 28.75,70.41 32.82,74.47 32.82,74.57
N$11
  Top 0.254: C2.1 67.06,28.96 67.06,34.04 66.45,34.65 62.48,34.65 60.76,32.92 56.9,32.92 53.95,29.97 53.95,29.87 53.34,29.26 IC2.P$4
N$12  (via drill 0.35)
  Top 0.254: v55.68,30.48 54.66,29.46 54.66,29.26 IC2.P$5
  Bottom 0.254: v55.68,30.48 61.47,30.48 62.48,31.5 65.02,31.5 C2.2
N$13  (via drill 0.35)
  Top 0.254: IC2.P$2 50.8,29.46 v51.92,30.58
  Bottom 0.254: v51.92,30.58 54.15,30.58 57.2,33.63 62.79,33.63 C4.1
N$14
  Top 0.254: IC2.P$6 55.88,29.26 56.49,29.87 56.49,29.97 57.61,31.09 62.08,31.09 64.62,33.63 66.04,33.63 C3.1
N$15  (via drill 0.35)
  Top 0.254: R15.2 11.48,75.59 11.48,79.05 16.26,83.82 R4.2 R8.2 33.73,83.72 34.34,83.72 38,80.06 39.93,80.06 IC3.11 40.03,79.96 40.69,79.3 | IC3.2 39.52,77.93 39.93,77.93 IC3.3 39.93,78.03 39.93,78.54 40.69,79.3 | 40.69,79.3 40.95,79.05 40.95,77.93 IC3.5 | v62.99,69.29 63.3,68.99 63.3,67.97 SJ4.1
  Bottom 0.254: v62.99,69.29 56.59,69.29 45.92,79.96 40.03,79.96 IC3.11
N$16
  Bottom 0.254: R8.1 34.85,76.2 35.87,75.18 44.7,75.18 C15.2
N$17  (via drill 0.35)
  Top 0.254: U2.5 72.03,63.2 72.03,63.91 72.85,64.72 76.81,64.72 R5.2 76.91,64.82 78.33,66.24 v78.33,66.45
  Bottom 0.254: U$1.19-A5/SCL0 71.53,5.08 73.15,6.71 76.61,6.71 92.25,22.35 92.25,63.5 89.31,66.45 v78.33,66.45
N$18  (via drill 0.35)
  Top 0.254: v62.18,75.49 60.25,73.56 60.25,65.94 64.11,62.08 68.78,62.08 69.9,60.96 72.14,60.96 73.46,59.64 73.46,58.83 U2.9 | v62.18,80.16 63.3,81.28 SJ5.1
  Bottom 0.254: v62.18,80.16 v62.18,75.49
N$19
  Top 0.254: C15.1 46.74,79.76 46.74,81.69 46.13,82.3 45.31,82.3 45.21,82.19 41.05,82.19 IC3.6 | U$2.4 31.09,81.28 36.17,76.2 R10.2
  Bottom 0.254: C15.1 38.81,78.74 36.27,76.2 R10.2
N$20
  Top 0.254: C17.+ 31.39,56.49 31.39,57.61 29.87,59.13 29.87,65.33 R12.2
N$21
  Top 1.397: 20.62,78.74 20.62,77.52 | 20.62,77.52 U$2.1 20.12,77.01 20.12,72.44 C14.+ 19.91,71.73 19.91,67.77 19.41,67.26 CON7.+ 19.1,66.65 19.1,61.57 19.41,60.96 | 20.62,78.74 U$2.2 | U$2.3 20.62,79.96 20.62,78.74 | 20.62,77.52 23.37,77.52 SJ3.2 | 19.41,60.96 19.41,55.78 CON8.+ 19.1,55.17 19.41,54.86 19.41,49.58 C12.+ 19.41,48.87 19.41,44.4 CON4.+ 19.1,43.79 19.1,38.71 19.41,38.1 | 19.41,60.96 C13.+ | C16.+ 19.41,3.86 19.41,9.14 19.1,9.45 CON6.+ 19.41,10.06 19.41,15.24 | 19.41,15.24 C9.+ | 19.41,38.1 19.41,32.92 CON5.+ 19.1,32.31 19.41,32 19.41,26.72 C10.+ 19.1,26.11 19.1,21.03 CON2.+ 19,20.32 19,18.29 19.1,18.19 19.1,15.85 19.41,15.24 | 19.41,38.1 C11.+
N$22  (1 unrouted)
  Bottom 0.254: R2.2 78.74,64.01 87.78,54.97 90.73,54.97 91.14,54.56 91.14,26.82 85.75,21.44 82.8,21.44 81.69,20.32 81.69,19.81 80.26,18.39 78.94,18.39 77.93,17.37 77.93,16.87 73.56,12.5 72.14,12.5 67.97,8.33 67.97,5.08 U$1.18-A4/SDA0
N$23  (via drill 0.35)
  Top 0.254: U2.6 72.03,58.73 72.03,57.81 74.27,55.58 75.29,55.58 76.81,57.1 R5.1 76.91,57.2 78.74,57.2 R2.1 | v62.48,42.77 39.52,42.77 31.7,34.95 30.48,34.95 R6.2 | v90.42,54.25 91.44,53.24 91.44,20.12 83.21,11.89 83.21,5.08 U$1.3V3-3
  Bottom 0.254: v62.48,42.77 76.81,57.1 R5.1 | v90.42,54.25 81.58,54.25 78.74,57.1 R2.1
N$24
  Top 0.254: C19.1 39.83,81.28 39.52,81.58 39.52,82.09 IC3.9
N$25
  Top 0.254: U$4.7 43.79,34.44 43.79,34.65 42.88,35.56 36.17,35.56 35.56,34.95 R1.1 35.46,34.95 33.02,34.95 R11.2
N$26  (via drill 0.35)
  Top 0.254: 35.26,84.23 35.26,83.41 35.87,82.8 36.58,82.8 36.68,82.91 39.83,82.91 40.03,82.7 40.03,82.19 IC3.8 | 35.26,84.23 35.87,84.84 44.7,84.84 C19.2 | SJ3.1 24.89,77.83 23.77,78.94 v21.95,78.94 | 35.26,84.23 34.65,84.23 34.04,84.84 14.43,84.84 8.33,78.74 LED3.A
  Bottom 0.254: v21.95,78.94 7.82,78.94 LED3.A
N$27
  Top 0.254: U$6.11 43.18,64.01 42.88,63.7 39.73,63.7 38.1,65.33 R16.1
N$29
  Top 0.254: D1.C 42.47,55.17 42.47,58.62 U$6.3
  Bottom 0.254: D1.C 46.02,58.73 53.14,58.73 54.05,57.81 55.88,57.81 0.1UF1.1
N$30
  Top 0.254: LED3.K 9.45,83.11 11.38,83.11 R15.1
N$31  (via drill 0.35)
  Top 0.254: v47.95,33.12 49.07,34.24 49.48,34.24 IC2.P$16 | v44.5,33.12 43.59,33.12 42.57,34.14 42.57,34.34 U$4.8 42.47,34.14 36.68,34.14 33.43,30.89 v33.02,30.89
  Bottom 0.254: v44.5,33.12 v47.95,33.12 48.06,33.12 52.12,37.19 63.3,37.19 65.23,35.26 66.45,35.26 67.06,35.87 67.06,36.68 72.03,41.66 76.81,41.66 78.94,39.52 85.95,39.52 87.07,40.64 P4.5 | v33.02,30.89 R11.1
N$33
  Top 0.254: 2.2UF,100V.1 43.89,62.79 43.89,64.41 U$6.10
N$34
  Top 0.254: 0.1UF2.1 54.86,65.02 52.32,65.02 52.12,65.23 42.88,65.23 42.57,64.92 42.57,64.52 U$6.12
N$35
  Top 0.254: 45.62,56.79 45.62,52.63 45.11,52.12 L1.1 | 45.62,56.79 45.62,59.84 45.01,60.45 43.18,60.45 41.96,59.23 41.96,58.73 U$6.2 | 45.62,56.79 49.28,56.79 51.21,58.73 52.53,58.73 54.05,60.25 55.88,60.25 0.1UF1.2
N$36  (via drill 0.35)
  Top 0.254: R14.1 32.41,65.43 35.56,65.43 R7.2 | 44.86,63.65 47.24,61.27 51.71,61.27 52.63,60.35 C8.2 | 44.86,63.65 44.5,64.01 44.5,64.41 U$6.9 | 44.86,63.65 v44.6,63.4
  Bottom 0.254: v44.6,63.4 38.71,63.4 36.78,65.33 35.56,65.33 R7.2
N$37
  Top 0.254: U$6.4 43.18,45.72 D1.A
O1_RX  (via drill 0.35)
  Top 0.254: v71.12,10.46 61.67,10.46 56.29,5.08 56.29,4.57 54.46,2.74 15.24,2.74 8.53,9.45 P2.2
  Bottom 0.254: v71.12,10.46 76.61,10.46 85.65,19.51 85.65,20.32 U$1.0-RX1/CS1/CRX2
O1_TX  (via drill 0.35)
  Top 0.254: v77.32,6.2 77.32,8.03 83.11,13.82 83.11,20.32 U$1.1-TX1/MISO1/CTX2
  Bottom 0.254: v77.32,6.2 77.32,5.79 76.61,5.08 76.61,4.57 74.27,2.23 13.72,2.23 8.53,7.42 P2.3
O2_RX  (via drill 0.35)
  Top 0.254: v61.57,21.13 61.06,21.13 60.76,21.44 42.16,21.44 41.05,20.32 41.05,19.81 39.83,18.59 v20.32,18.59
  Bottom 0.254: U$1.7-RX2/OUT1A 66.95,20.32 65.84,21.44 61.87,21.44 v61.57,21.13 | v20.32,18.59 10.87,18.59 8.53,20.93 P5.2
O2_TX  (via drill 0.35)
  Top 0.254: U$1.8-TX2/IN1 65.02,20.32 63.3,18.59 44.91,18.59 42.98,16.66 v20.42,16.66
  Bottom 0.254: v20.42,16.66 10.77,16.66 8.53,18.9 P5.3
O3_RX
  Bottom 0.254: U$1.15-A1/RX3/SPDIF_IN 59.94,5.08 58.42,3.56 42.57,3.56 41.05,5.08 41.05,5.59 20.93,25.7 11.58,25.7 7.32,29.97 7.32,31.19 8.43,32.31 P6.2
O3_TX
  Bottom 0.254: U$1.14-A0/TX3/SPDIF_OUT 56.79,5.08 42.67,19.2 28.25,19.2 17.17,30.28 8.53,30.28 P6.3
O4_RX  (via drill 0.35)
  Top 0.254: v64.21,6.91 62.89,5.59 62.89,5.08 U$1.16-A2/RX4/SCL1
  Bottom 0.254: v64.21,6.91 57,6.91 43.59,20.32 43.59,20.83 38.1,26.31 27.43,26.31 9.96,43.79 8.53,43.79 P7.2
O4_TX
  Bottom 0.254: U$1.17-A3/TX4/SDA1 64.41,5.08 62.38,3.05 40.54,3.05 38.51,5.08 38.51,5.59 18.8,25.3 11.38,25.3 6.91,29.77 6.91,40.23 8.43,41.76 P7.3
O5_RX
  Bottom 0.254: U$1.21-A7/RX5/BCLK1 74.57,5.08 72.14,2.64 38.41,2.64 35.97,5.08 35.97,5.59 22.25,19.3 17.98,19.3 12.39,24.89 11.18,24.89 6.5,29.57 6.5,53.24 8.43,55.17 P8.2
O5_TX
  Top 0.254: U$1.20-A6/TX5/LRCLK1 72.03,5.08 68.17,1.22 12.09,1.22 6.91,6.4 6.91,51.61 8.43,53.14 P8.3
O6_RX
  Bottom 0.254: U$1.25-A11/RX6/SDA2 47.55,20.32 39.01,28.85 37.59,28.85 36.37,30.07 36.37,34.34 36.58,34.54 36.58,35.36 16.05,55.88 16.05,59.13 8.53,66.65 P9.2
O6_TX
  Bottom 0.254: U$1.24-A10/TX6/SCL2 49.17,20.32 48.06,19.2 47.24,19.2 46.13,20.32 46.13,20.83 38.51,28.45 37.39,28.45 31.5,34.34 31.5,39.83 15.65,55.68 15.65,57.51 8.53,64.62 P9.3
SENS1
  Top 0.254: U$1.22-A8/CTX1 78.13,5.08 78.13,8.23 90.63,20.73 90.63,42.37 85.65,47.35 P1.3
SENS2
  Top 0.254: U$1.23-A9/CRX1/MCLK1 80.67,5.08 80.67,9.96 91.03,20.32 91.03,47.65 85.65,53.03 P11.3
SENS3
  Bottom 0.254: U$1.38-A14/CS/IN1 43.59,5.08 44.7,3.96 58.22,3.96 59.23,4.98 59.23,5.49 59.94,6.2 65.84,6.2 66.85,5.18 66.85,4.67 67.56,3.96 68.38,3.96 69.39,4.98 69.39,5.49 72.64,8.74 77.01,8.74 87.17,18.9 87.17,22.25 91.85,26.92 91.85,54.46 88.7,57.61 86.77,57.61 85.65,58.73 P12.3
SENS4  (via drill 0.35)
  Top 0.254: v41.25,17.98 42.47,19.2 63.3,19.2 64.31,20.22 64.31,24.79 76.1,36.58 76.1,52.53 85.55,61.98 85.55,64.52 P13.3
  Bottom 0.254: v41.25,17.98 41.25,9.96 42.16,9.04 42.67,9.04 45.01,6.71 45.01,5.08 U$1.39-A15/CS/OUT1A
T_RX
  Top 0.254: IC2.P$12 54.56,34.24 54.56,33.22 53.03,31.7 46.43,31.7 44.91,30.18 44.7,30.18 44.4,29.87 44.4,24.69 40.03,20.32 U$1.28-RX7
T_TX
  Top 0.254: IC2.P$11 55.88,34.34 55.27,34.95 55.27,35.05 54.15,36.17 49.58,36.17 44.7,31.29 43.28,31.29 37.49,25.5 37.49,20.32 U$1.29-TX7